# EAGLE schematic shutter (EAGLE 6.1)
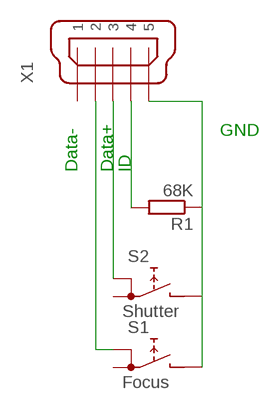
[diagram p0: schematic, sheet 1]

## Parts
R1  68K  R-EU_0309/10  [0309/10]
S1  Focus  RDT1034  [RDT1034]
S2  Shutter  RDT1034  [RDT1034]
X1  MINI-USB-32005-301  [32005-301]

## Nets
N$1: S1.A X1.2
N$2: S2.A X1.3
N$3: R1.2 X1.4
N$4: R1.1 S1.B S2.B X1.5
Unconnected: S1.A1 S2.A1 X1.1

## Notes on the sheet
- GND
- Data- | Data+ | ID

## Library data of the parts
R1 = resistor:R-EU_: RESISTOR, European symbol
S1 S2 = switch:RDT1034: PUSH SWITCH www.radiohm.com
X1 = con-cypressindustries:MINI-USB-: MINI USB-B Conector Source: www.cypressindustries.com; OC_FARNELL: unknown; OC_NEWARK: unknown